# Altium schematic sheet 03-旋钮模块-原理图.SchDoc
size A4
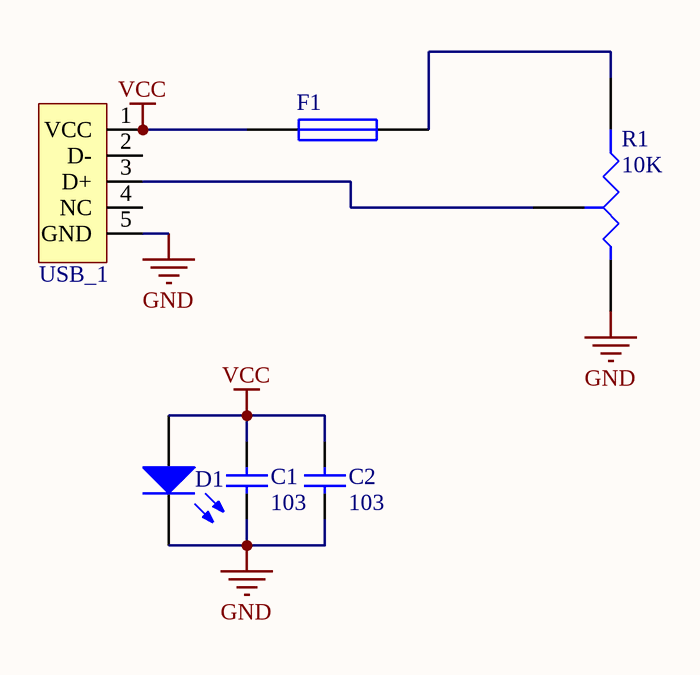
[diagram p0: 03-旋钮模块-原理图.SchDoc]

## Parts
C1  value 103  [0805]  (hidden comment: Cap)
C2  value 103  [0805]  (hidden comment: Cap)
D1  LED0  [0805]  (value not drawn)
F1  Fuse 1  [Fuse]  (value not drawn)
R1  value 10K  [滑动电阻器]  (hidden comment: Res Tap)
USB_1  USB  [USB/SM0.8-6H5]  (value not drawn)

## Nets
GND: C1.2 C2.2 D1.2(K) R1.1(A) USB_1.5(GND)
VCC: C1.1 C2.1 D1.1(A) F1.1 USB_1.1(VCC)
NetF1_2: F1.2 R1.2(B)
NetR1_3: R1.3(TAP) USB_1.3(D+)

Not connected (* = marked no-connect by the designer): USB_1 2(D-) 4(NC)

## Library data of the parts
C1 C2 = Cap: Capacitor; Published: 8-Jun-2000; LatestRevisionDate: 17-Jul-2002; LatestRevisionNote: Re-released for DXP Platform.; PackageReference: RAD-0.3; Publisher: Altium Limited
D1 = LED0: Typical INFRARED GaAs LED; Published: 8-Jun-2000; LatestRevisionDate: 08-Jul-2005; LatestRevisionNote: Mech Layer 1 removed.; PackageReference: LED-0; Publisher: Altium Limited
F1 = Fuse 1: Fuse; Published: 8-Jun-2000; LatestRevisionDate: 17-Jul-2002; LatestRevisionNote: Re-released for DXP Platform.; PackageReference: PIN-W2/E2.8; Publisher: Altium Limited
R1 = Res Tap: Tapped Resistor; Sim Note: Enter the Resistance value and the set point into parameter fields.; Set Position: 0.5; Published: 24-Mar-1999; LatestRevisionDate: 17-Jul-2002; LatestRevisionNote: Re-released for DXP Platform.; PackageReference: VR3; Publisher: Altium Limited
USB_1 = USB5